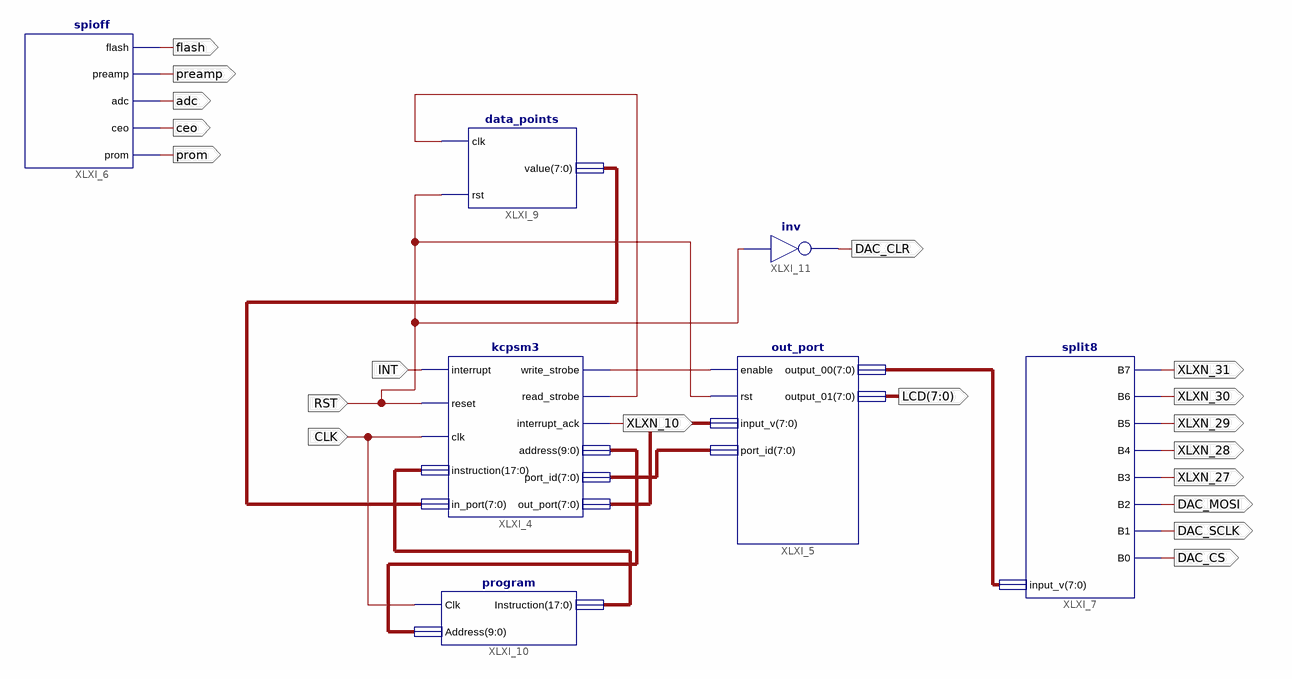
[diagram p0: schematic sheet 1]
// Xilinx ISE schematic main.sch (spartan3e) as structural Verilog: 7 symbols, 19 ports
module main (
  input  CLK,
  input  RST,
  input  INT,
  output [7:0] LCD,
  output XLXN_10,
  output flash,
  output preamp,
  output adc,
  output ceo,
  output prom,
  output DAC_CS,
  output DAC_SCLK,
  output DAC_MOSI,
  output XLXN_28,
  output XLXN_29,
  output XLXN_30,
  output XLXN_31,
  output XLXN_27,
  output DAC_CLR
);

  wire XLXN_1, XLXN_17;
  wire [7:0] XLXN_2, XLXN_3, XLXN_4, XLXN_19;
  wire [9:0] XLXN_20;
  wire [17:0] XLXN_21;

  kcpsm3 XLXI_4 (
    .interrupt(INT), .reset(RST), .clk(CLK), .instruction(XLXN_21), .in_port(XLXN_19), .write_strobe(XLXN_1),
    .read_strobe(XLXN_17), .interrupt_ack(XLXN_10), .address(XLXN_20), .port_id(XLXN_2), .out_port(XLXN_3));
  out_port XLXI_5 (.enable(XLXN_1), .rst(RST), .input_v(XLXN_3), .port_id(XLXN_2), .output_00(XLXN_4), .output_01(LCD));
  split8 XLXI_7 (
    .B7(XLXN_31), .B6(XLXN_30), .B5(XLXN_29), .B4(XLXN_28), .B3(XLXN_27), .B2(DAC_MOSI), .B1(DAC_SCLK),
    .B0(DAC_CS), .input_v(XLXN_4));
  spioff XLXI_6 (.flash(flash), .preamp(preamp), .adc(adc), .ceo(ceo), .prom(prom));
  data_points XLXI_9 (.clk(XLXN_17), .value(XLXN_19), .rst(RST));
  \program  XLXI_10 (.Clk(CLK), .Address(XLXN_20), .Instruction(XLXN_21));
  not XLXI_11 (DAC_CLR, RST);
endmodule
